# EAGLE design PoolTable (EAGLE 9.3.0)
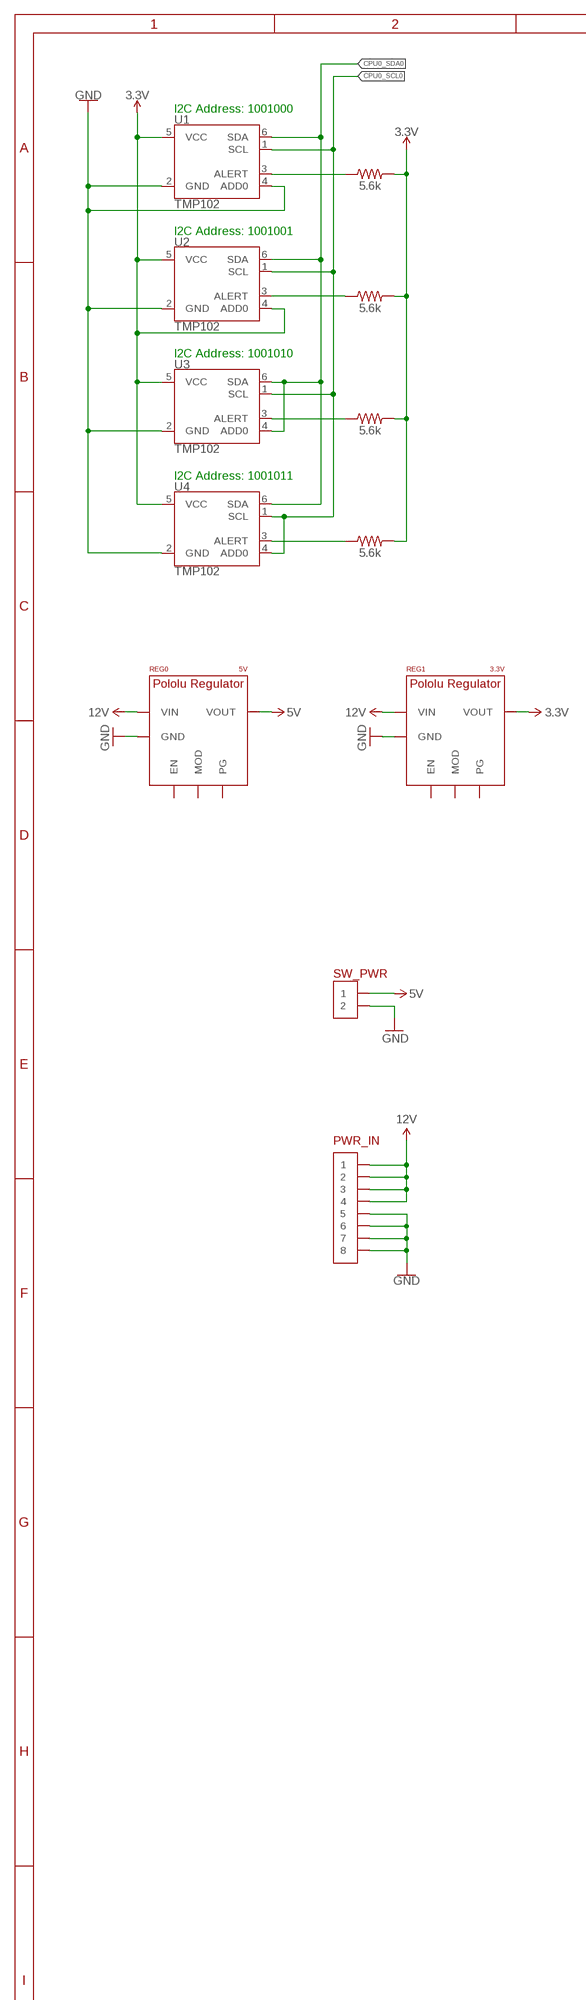
[diagram p0: schematic, sheet 1, part 1 of 2]
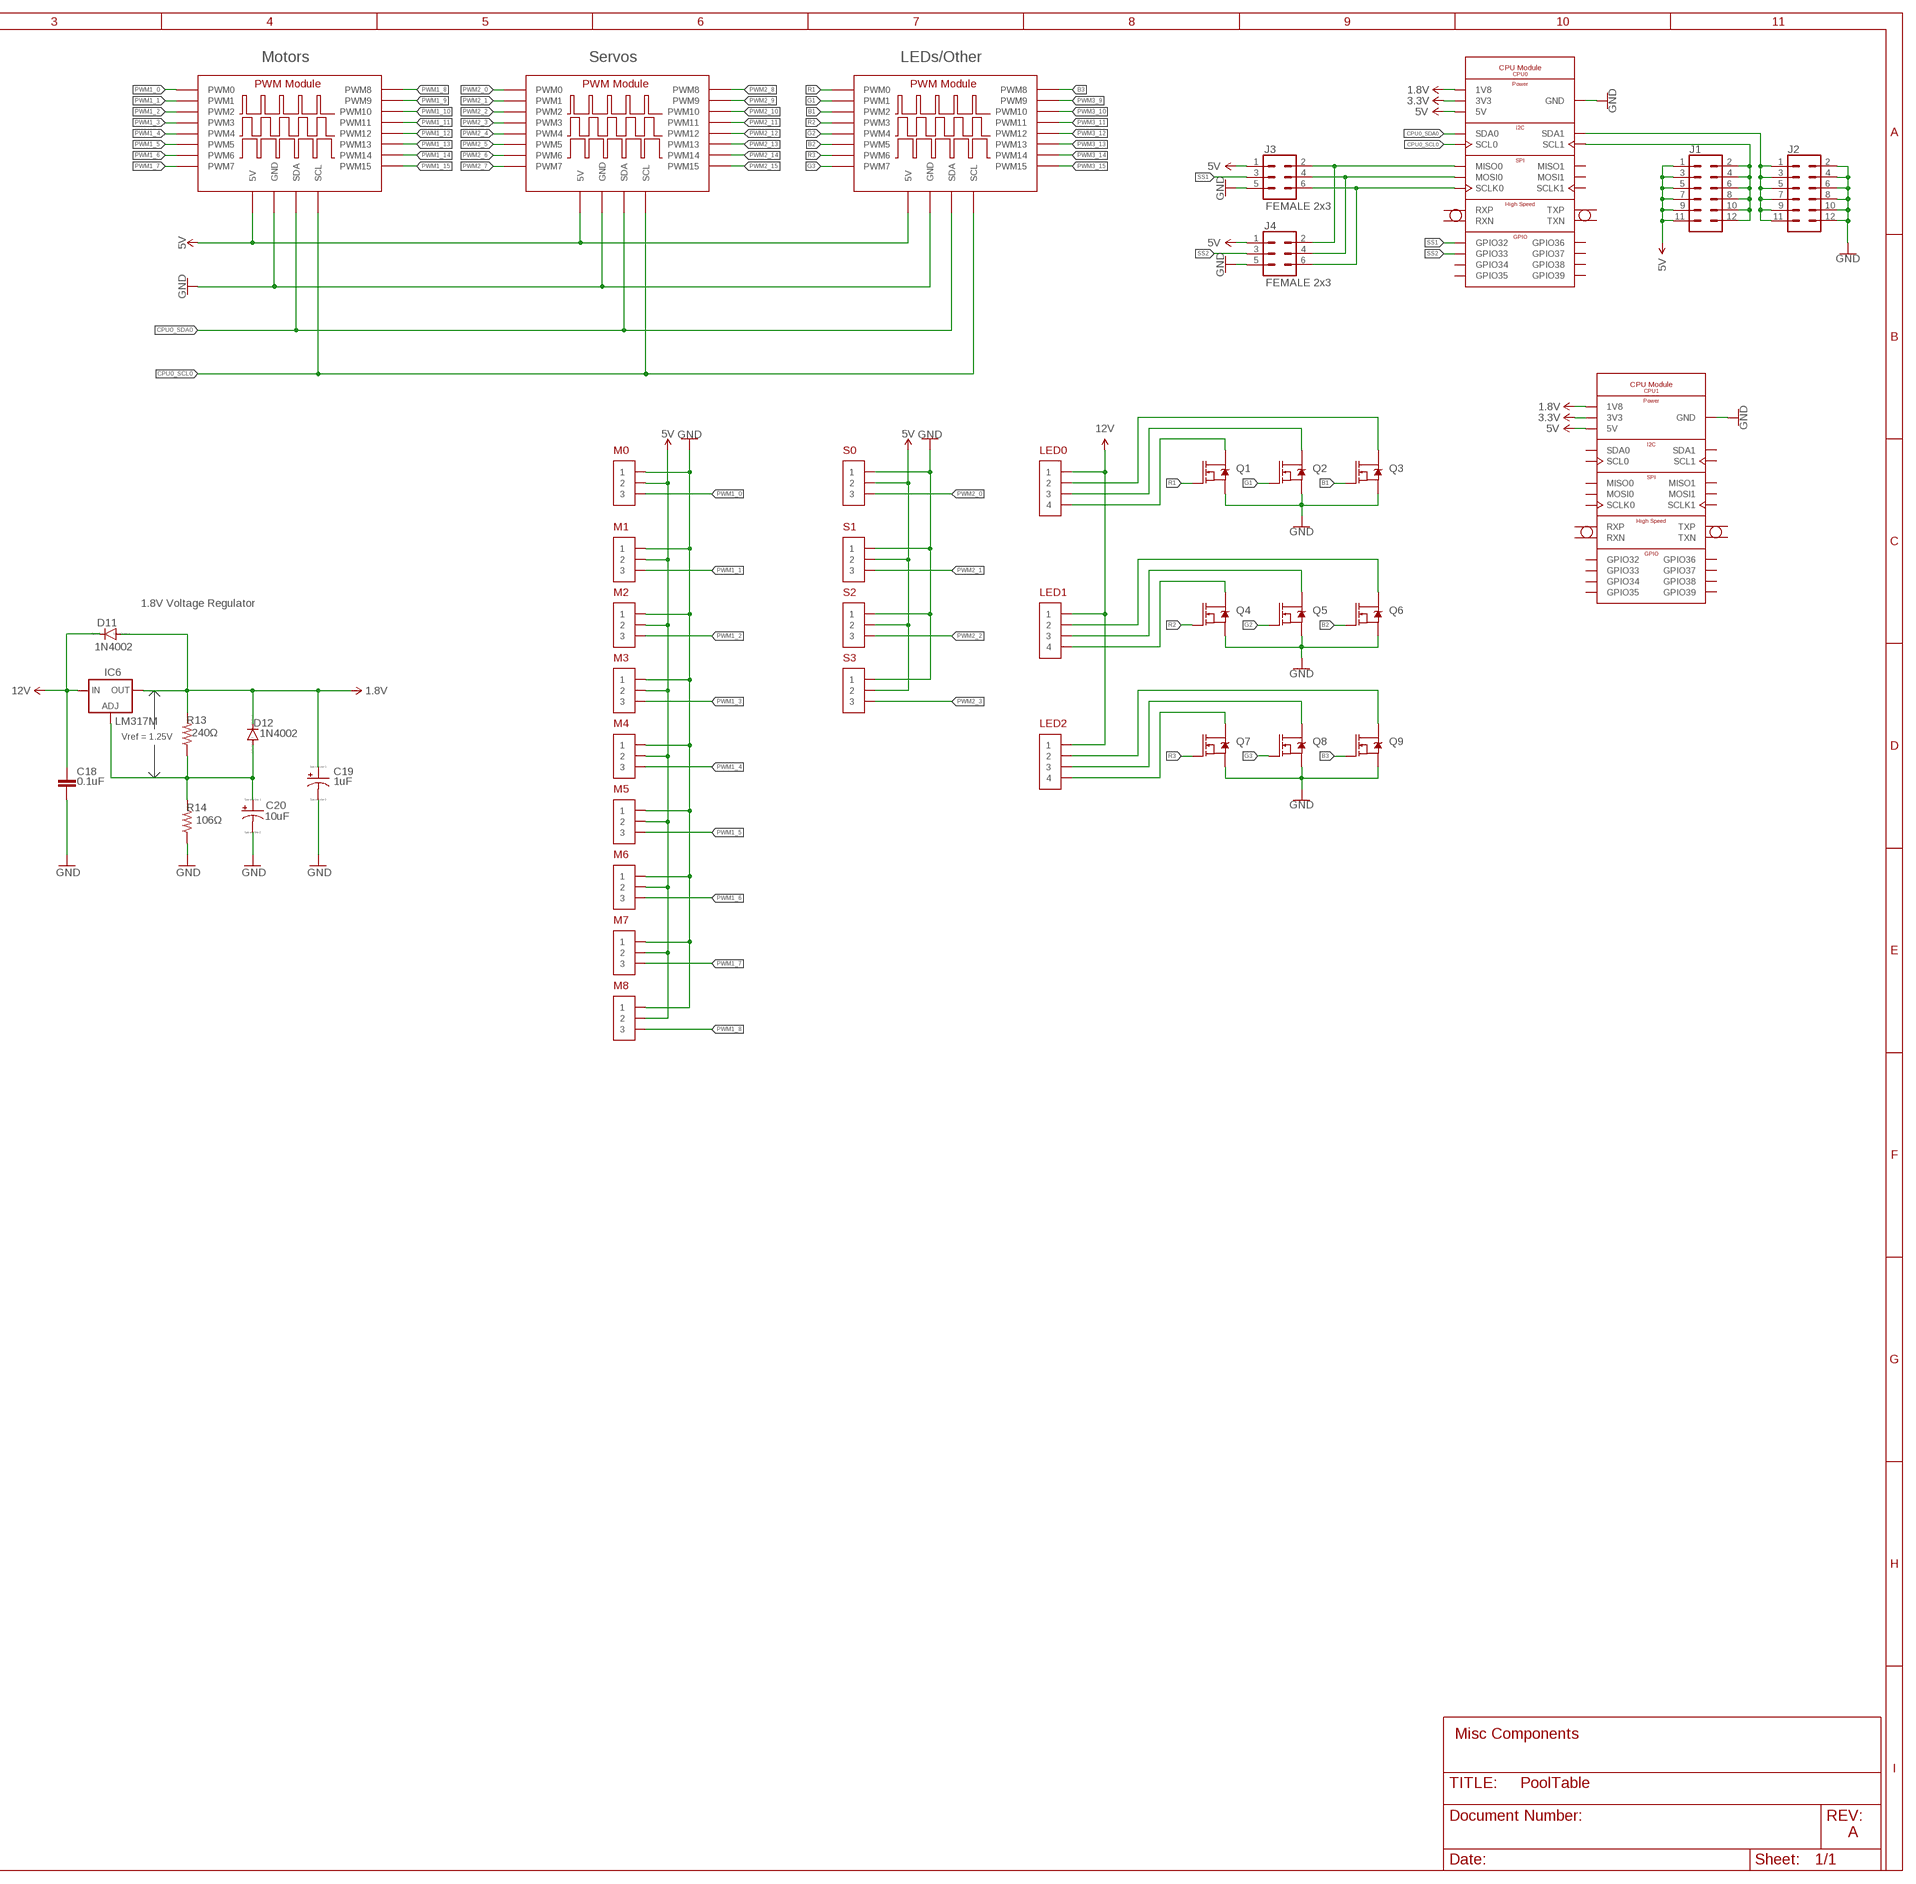
[diagram p1: schematic, sheet 1, part 2 of 2]

## Parts
C18  0.1uF  C-EU075-052X106  [C075-052X106]
C19  1uF  CPOL-US085CS-1AR  [085CS_1AR]
C20  10uF  CPOL-US085CS-1AR  [085CS_1AR]
CPU0  CPU_MODULE  [CPU_MODULE]
CPU1  CPU_MODULE  [CPU_MODULE]
D11  1N4002  1N4004  [DO41-10]
D12  1N4002  1N4004  [DO41-10]
IC6  LM317MBSTT3  [SOT223]
J1  2X6 FEMALE  CONN_06X2PTH_FEMALE  [2X6]
J2  2X6 FEMALE  CONN_06X2PTH_FEMALE  [2X6]
J3  FEMALE 2x3  CONN_03X2FEMALE  [2X3]
J4  FEMALE 2x3  CONN_03X2FEMALE  [2X3]
LED0  MOLEX-ULTRAFIT-1X04VERT  [MOLEX-ULTRAFIT-1X04V]
LED1  MOLEX-ULTRAFIT-1X04VERT  [MOLEX-ULTRAFIT-1X04V]
LED2  MOLEX-ULTRAFIT-1X04VERT  [MOLEX-ULTRAFIT-1X04V]
M0  MOLEX-ULTRAFIT-1X03-VERT  [MOLEX-ULTRAFIT-1X03V]
M1  MOLEX-ULTRAFIT-1X03VERT  [MOLEX-ULTRAFIT-1X03V]
M2  MOLEX-ULTRAFIT-1X03VERT  [MOLEX-ULTRAFIT-1X03V]
M3  MOLEX-ULTRAFIT-1X03VERT  [MOLEX-ULTRAFIT-1X03V]
M4  MOLEX-ULTRAFIT-1X03VERT  [MOLEX-ULTRAFIT-1X03V]
M5  MOLEX-ULTRAFIT-1X03VERT  [MOLEX-ULTRAFIT-1X03V]
M6  MOLEX-ULTRAFIT-1X03VERT  [MOLEX-ULTRAFIT-1X03V]
M7  MOLEX-ULTRAFIT-1X03VERT  [MOLEX-ULTRAFIT-1X03V]
M8  MOLEX-ULTRAFIT-1X03-VERT  [MOLEX-ULTRAFIT-1X03V]
PWM0  PWM_MODULE  [PWM_MODULE]
PWM1  PWM_MODULE  [PWM_MODULE]
PWM2  PWM_MODULE  [PWM_MODULE]
PWR_IN  MOLEX-ULTRAFIT-1X08  [MOLEX-ULTRAFIT-1X08]
Q1  60V/32A/35mΩ  MOSFET-NCH-FQP30N06L  [TO220V]
Q2  60V/32A/35mΩ  MOSFET-NCH-FQP30N06L  [TO220V]
Q3  60V/32A/35mΩ  MOSFET-NCH-FQP30N06L  [TO220V]
Q4  60V/32A/35mΩ  MOSFET-NCH-FQP30N06L  [TO220V]
Q5  60V/32A/35mΩ  MOSFET-NCH-FQP30N06L  [TO220V]
Q6  60V/32A/35mΩ  MOSFET-NCH-FQP30N06L  [TO220V]
Q7  60V/32A/35mΩ  MOSFET-NCH-FQP30N06L  [TO220V]
Q8  60V/32A/35mΩ  MOSFET-NCH-FQP30N06L  [TO220V]
Q9  60V/32A/35mΩ  MOSFET-NCH-FQP30N06L  [TO220V]
R9  5.6k  5.6KOHM-0603-1/10W-1%  [0603]
R12  5.6k  5.6KOHM-0603-1/10W-1%  [0603]
R13  240Ω  R-US_M0805  [M0805]
R14  106Ω  R-US_M0805  [M0805]
R15  5.6k  5.6KOHM-0603-1/10W-1%  [0603]
R18  5.6k  5.6KOHM-0603-1/10W-1%  [0603]
REG0  5V  POLOLU-REG  [POLOLU-REG]
REG1  3.3V  POLOLU-REG  [POLOLU-REG]
S0  MOLEX-ULTRAFIT-1X03VERT  [MOLEX-ULTRAFIT-1X03V]
S1  MOLEX-ULTRAFIT-1X03-VERT  [MOLEX-ULTRAFIT-1X03V]
S2  MOLEX-ULTRAFIT-1X03VERT  [MOLEX-ULTRAFIT-1X03V]
S3  MOLEX-ULTRAFIT-1X03VERT  [MOLEX-ULTRAFIT-1X03V]
SW_PWR  MOLEX-ULTRAFIT-1X02-HORIZ  [MOLEX-ULTRAFIT-1X02H]
U1  TMP102  [SOT563]
U2  TMP102  [SOT563]
U3  TMP102  [SOT563]
U4  TMP102  [SOT563]

## Nets
1.8V: C19.+ CPU0.19(1V8) CPU1.19(1V8) D11.A D12.C IC6.4(OUT) R13.2
3.3V: CPU0.20(3V3) CPU1.20(3V3) R9.2 R12.2 R15.2 R18.2 REG1.P$4(VOUT) REG1.P$7(VOUT) REG1.P$8(VOUT) U1.5(VCC) U2.4(ADD0) U2.5(VCC) U3.5(VCC) U4.5(VCC)
5V: CPU0.18(5V) CPU1.18(5V) J1.1 J1.3 J1.5 J1.7 J1.9 J1.11 J3.1 J4.1 M0.P$2 M1.P$2 M2.P$2 M3.P$2 M4.P$2 M5.P$2 M6.P$2 M7.P$2 M8.P$2 PWM0.5V PWM1.5V PWM2.5V REG0.P$4(VOUT) REG0.P$7(VOUT) REG0.P$8(VOUT) S0.P$2 S1.P$2 S2.P$2 S3.P$2 SW_PWR.P$1
12V: C18.1 D11.C IC6.3(IN) LED0.P$1 LED1.P$1 LED2.P$1 PWR_IN.P$1 PWR_IN.P$2 PWR_IN.P$3 PWR_IN.P$4 REG0.P$1(VIN) REG0.P$14(VIN) REG0.P$15(VIN) REG1.P$1(VIN) REG1.P$14(VIN) REG1.P$15(VIN)
B1: PWM1.PWM2 Q3.1(G)
B2: PWM1.PWM5 Q6.1(G)
B3: PWM1.PWM8 Q9.1(G)
CPU0_SCL0: CPU0.15(SCL0) PWM0.SCL PWM1.SCL PWM2.SCL U1.1(SCL) U2.1(SCL) U3.1(SCL) U4.1(SCL) U4.4(ADD0)
CPU0_SDA0: CPU0.13(SDA0) PWM0.SDA PWM1.SDA PWM2.SDA U1.6(SDA) U2.6(SDA) U3.4(ADD0) U3.6(SDA) U4.6(SDA)
G1: PWM1.PWM1 Q2.1(G)
G2: PWM1.PWM4 Q5.1(G)
G3: PWM1.PWM7 Q8.1(G)
GND: C18.2 C19.- C20.- CPU0.1(GND) CPU0.2(GND) CPU0.3(GND) CPU0.6(GND) CPU0.7(GND) CPU0.10(GND) CPU0.11(GND) CPU0.14(GND) CPU0.17(GND) CPU0.21(GND) CPU0.24(GND) CPU0.27(GND) CPU0.30(GND) CPU0.33(GND) CPU0.37(GND) CPU1.1(GND) CPU1.2(GND) CPU1.3(GND) CPU1.6(GND) CPU1.7(GND) CPU1.10(GND) CPU1.11(GND) CPU1.14(GND) CPU1.17(GND) CPU1.21(GND) CPU1.24(GND) CPU1.27(GND) CPU1.30(GND) CPU1.33(GND) CPU1.37(GND) J2.2 J2.4 J2.6 J2.8 J2.10 J2.12 J3.5 J4.5 M0.P$1 M1.P$1 M2.P$1 M3.P$1 M4.P$1 M5.P$1 M6.P$1 M7.P$1 M8.P$1 PWM0.GND PWM1.GND PWM2.GND PWR_IN.P$5 PWR_IN.P$6 PWR_IN.P$7 PWR_IN.P$8 Q1.3(S) Q2.3(S) Q3.3(S) Q4.3(S) Q5.3(S) Q6.3(S) Q7.3(S) Q8.3(S) Q9.3(S) R14.1 REG0.P$2(GND) REG0.P$3(GND) REG0.P$5(GND) REG0.P$6(GND) REG0.P$11(GND) REG0.P$12(GND) REG0.P$16(GND) REG0.P$17(GND) REG1.P$2(GND) REG1.P$3(GND) REG1.P$5(GND) REG1.P$6(GND) REG1.P$11(GND) REG1.P$12(GND) REG1.P$16(GND) REG1.P$17(GND) S0.P$1 S1.P$1 S2.P$1 S3.P$1 SW_PWR.P$2 U1.2(GND) U1.4(ADD0) U2.2(GND) U3.2(GND) U4.2(GND)
N$1: LED0.P$4 Q1.2(D)
N$2: LED0.P$3 Q2.2(D)
N$3: LED0.P$2 Q3.2(D)
N$4: CPU0.12(SCL1) J1.2 J1.4 J1.6 J1.8 J1.10 J1.12
N$5: CPU0.16(SDA1) J2.1 J2.3 J2.5 J2.7 J2.9 J2.11
N$6: R9.1 U1.3(ALERT)
N$7: C20.+ D12.A IC6.1(ADJ) R13.1 R14.2
N$8: LED1.P$4 Q4.2(D)
N$9: R12.1 U3.3(ALERT)
N$10: LED1.P$3 Q5.2(D)
N$11: LED1.P$2 Q6.2(D)
N$12: R15.1 U4.3(ALERT)
N$13: LED2.P$4 Q7.2(D)
N$14: LED2.P$3 Q8.2(D)
N$15: R18.1 U2.3(ALERT)
N$16: LED2.P$2 Q9.2(D)
N$17: CPU0.39(MISO0) J3.2 J4.2
N$18: CPU0.40(MOSI0) J3.4 J4.4
N$19: CPU0.38(SCLK0) J3.6 J4.6
PWM1_0: M0.P$3 PWM0.PWM0
PWM1_1: M1.P$3 PWM0.PWM1
PWM1_2: M2.P$3 PWM0.PWM2
PWM1_3: M3.P$3 PWM0.PWM3
PWM1_4: M4.P$3 PWM0.PWM4
PWM1_5: M5.P$3 PWM0.PWM5
PWM1_6: M6.P$3 PWM0.PWM6
PWM1_7: M7.P$3 PWM0.PWM7
PWM1_8: M8.P$3 PWM0.PWM8
PWM1_9: PWM0.PWM9
PWM1_10: PWM0.PWM10
PWM1_11: PWM0.PWM11
PWM1_12: PWM0.PWM12
PWM1_13: PWM0.PWM13
PWM1_14: PWM0.PWM14
PWM1_15: PWM0.PWM15
PWM2_0: PWM2.PWM0 S0.P$3
PWM2_1: PWM2.PWM1 S1.P$3
PWM2_2: PWM2.PWM2 S2.P$3
PWM2_3: PWM2.PWM3 S3.P$3
PWM2_4: PWM2.PWM4
PWM2_5: PWM2.PWM5
PWM2_6: PWM2.PWM6
PWM2_7: PWM2.PWM7
PWM2_8: PWM2.PWM8
PWM2_9: PWM2.PWM9
PWM2_10: PWM2.PWM10
PWM2_11: PWM2.PWM11
PWM2_12: PWM2.PWM12
PWM2_13: PWM2.PWM13
PWM2_14: PWM2.PWM14
PWM2_15: PWM2.PWM15
PWM3_9: PWM1.PWM9
PWM3_10: PWM1.PWM10
PWM3_11: PWM1.PWM11
PWM3_12: PWM1.PWM12
PWM3_13: PWM1.PWM13
PWM3_14: PWM1.PWM14
PWM3_15: PWM1.PWM15
R1: PWM1.PWM0 Q1.1(G)
R2: PWM1.PWM3 Q4.1(G)
R3: PWM1.PWM6 Q7.1(G)
SS1: CPU0.32(GPIO32) J3.3
SS2: CPU0.31(GPIO33) J4.3
Unconnected: CPU0.4(TXN) CPU0.5(TXP) CPU0.8(RXN) CPU0.9(RXP) CPU0.22(GPIO39) CPU0.23(GPIO38) CPU0.25(GPIO37) CPU0.26(GPIO36) CPU0.28(GPIO35) CPU0.29(GPIO34) CPU0.34(SCLK1) CPU0.35(MISO1) CPU0.36(MOSI1) CPU1.4(TXN) CPU1.5(TXP) CPU1.8(RXN) CPU1.9(RXP) CPU1.12(SCL1) CPU1.13(SDA0) CPU1.15(SCL0) CPU1.16(SDA1) CPU1.22(GPIO39) CPU1.23(GPIO38) CPU1.25(GPIO37) CPU1.26(GPIO36) CPU1.28(GPIO35) CPU1.29(GPIO34) CPU1.31(GPIO33) CPU1.32(GPIO32) CPU1.34(SCLK1) CPU1.35(MISO1) CPU1.36(MOSI1) CPU1.38(SCLK0) CPU1.39(MISO0) CPU1.40(MOSI0) REG0.P$9(PG) REG0.P$10(MOD) REG0.P$13(EN) REG1.P$9(PG) REG1.P$10(MOD) REG1.P$13(EN)

## Notes on the sheet
- Motors | Servos | LEDs/Other
- I2C Address: 1001000
- I2C Address: 1001001
- I2C Address: 1001010
- I2C Address: 1001011
- 1.8V Voltage Regulator
- Vref = 1.25V
- Misc Components
- A

## Library data of the parts
C18 = rcl:C-EU: CAPACITOR, European symbol; SPICEPREFIX: C
C19 C20 = resistor:CPOL-US: POLARIZED CAPACITOR, American symbol
CPU0 CPU1 = Modules:CPU_MODULE
D11 D12 = diode:1N4004: DIODE general purpose rectifier, 1 A
IC6 = v-reg:LM317?*: 500 mA Adjustable Output Positive Voltage Regulator Source: http://www.onsemi.co.jp .. LM317M-D.PDF; PARTNUMBER: LM317M
J1 J2 = SparkFun-Connectors:CONN_06X2: Multi connection point. Often used as Generic Header-pin footprint for 0.1 inch spaced/style header connections On any of the 0.1 inch spaced packages, you can populate with these: Break Away Headers - Straight (PRT-00116) Break Away Male Headers - Right Angle (PRT-00553) Female Headers (PRT-00115) Break Away Headers - Machine Pin (PRT-00117) Break Away Female Headers - Swiss Machine Pin (PRT-00743); PROD_ID: CONN-12423
J3 J4 = SparkFun-Connectors:CONN_03X2: Multi connection point. Often used as Generic Header-pin footprint for 0.1 inch spaced/style header connections You can populate with any combo of single row headers, but if you'd like an exact match, check these: Header - 2x3 (Male, 0.1") (PRT-12807) Header - 2x3 (Female, 0.1") (PRT-13010) 2x3 Pin Shrouded Header (PRT-10877) On any of the 0.1 inch spaced packages, you can populate with these: Break Away Headers - Straight (PRT-00116) Break Away Male Headers - Right Angle (PRT-00553) Female Headers (PRT-00115) Break Away Headers - Machine Pin (PRT-00117) Break Away Female Headers - Swiss Machine Pin (PRT-00743) Special note: the shrouded connector mates well with our 3x2 ribbon cables: Ribbon Crimp Connector - 6-pin (2x3, Female) (PRT-10651) Ribbon Cable - 6 wire (15ft) (PRT-10646); PROD_ID: CONN-11566
LED0 LED1 LED2 = External:MOLEX-ULTRAFIT-1X04
M0 M8 S1 = MolexUltrafit:MOLEX-ULTRAFIT-1X03
M1-M7 S0 S2 S3 = External:MOLEX-ULTRAFIT-1X03
PWM0 PWM1 PWM2 = Modules:PWM_MODULE
PWR_IN = External:MOLEX-ULTRAFIT-1X08
Q1-Q9 = SparkFun-DiscreteSemi:MOSFET-NCH: N-channel MOSFETs Voltage controlled devices that allow control of high current outputs. SparkFun Products: SparkFun OpenScale <https://www.sparkfun.com/products/13261> SparkFun Digital Sandbox <https://www.sparkfun.com/products/12651> SparkFun Monster Moto Shield <https://www.sparkfun.com/products/10182> SparkFun MOSFET Power Controller <https://www.sparkfun.com/products/11214>; PROD_ID: TRANS-10060
R9 R12 R15 R18 = SparkFun-Resistors:5.6KOHM: 5.6kΩ resistor A resistor is a passive two-terminal electrical component that implements electrical resistance as a circuit element. Resistors act to reduce current flow, and, at the same time, act to lower voltage levels within circuits. - Wikipedia; PROD_ID: RES-12378
R13 R14 = resistor:R-US_: RESISTOR, American symbol
REG0 REG1 = External:POLOLU-REG
SW_PWR = MolexUltrafit:MOLEX-ULTRAFIT-1X02
U1-U4 = SparkFun-Sensors:TMP102: Texas Instruments TMP102 Low-Power Digital Temperature Sensor The TMP102 is a digital sensor (I2C a.k.a. TWI), has a resolution of 0.0625°C, and is accurate up to 0.5°C. This is a very handy sensor that requires a very low-current. Datasheet SparkFun Products SparkFun Digital Temperature Sensor Breakout - TMP102 (SEN-11931); PROD_ID: IC-09303

## Net classes
0 default: width 0.254 mm
1 diff pair: width 0.406 mm

## Board
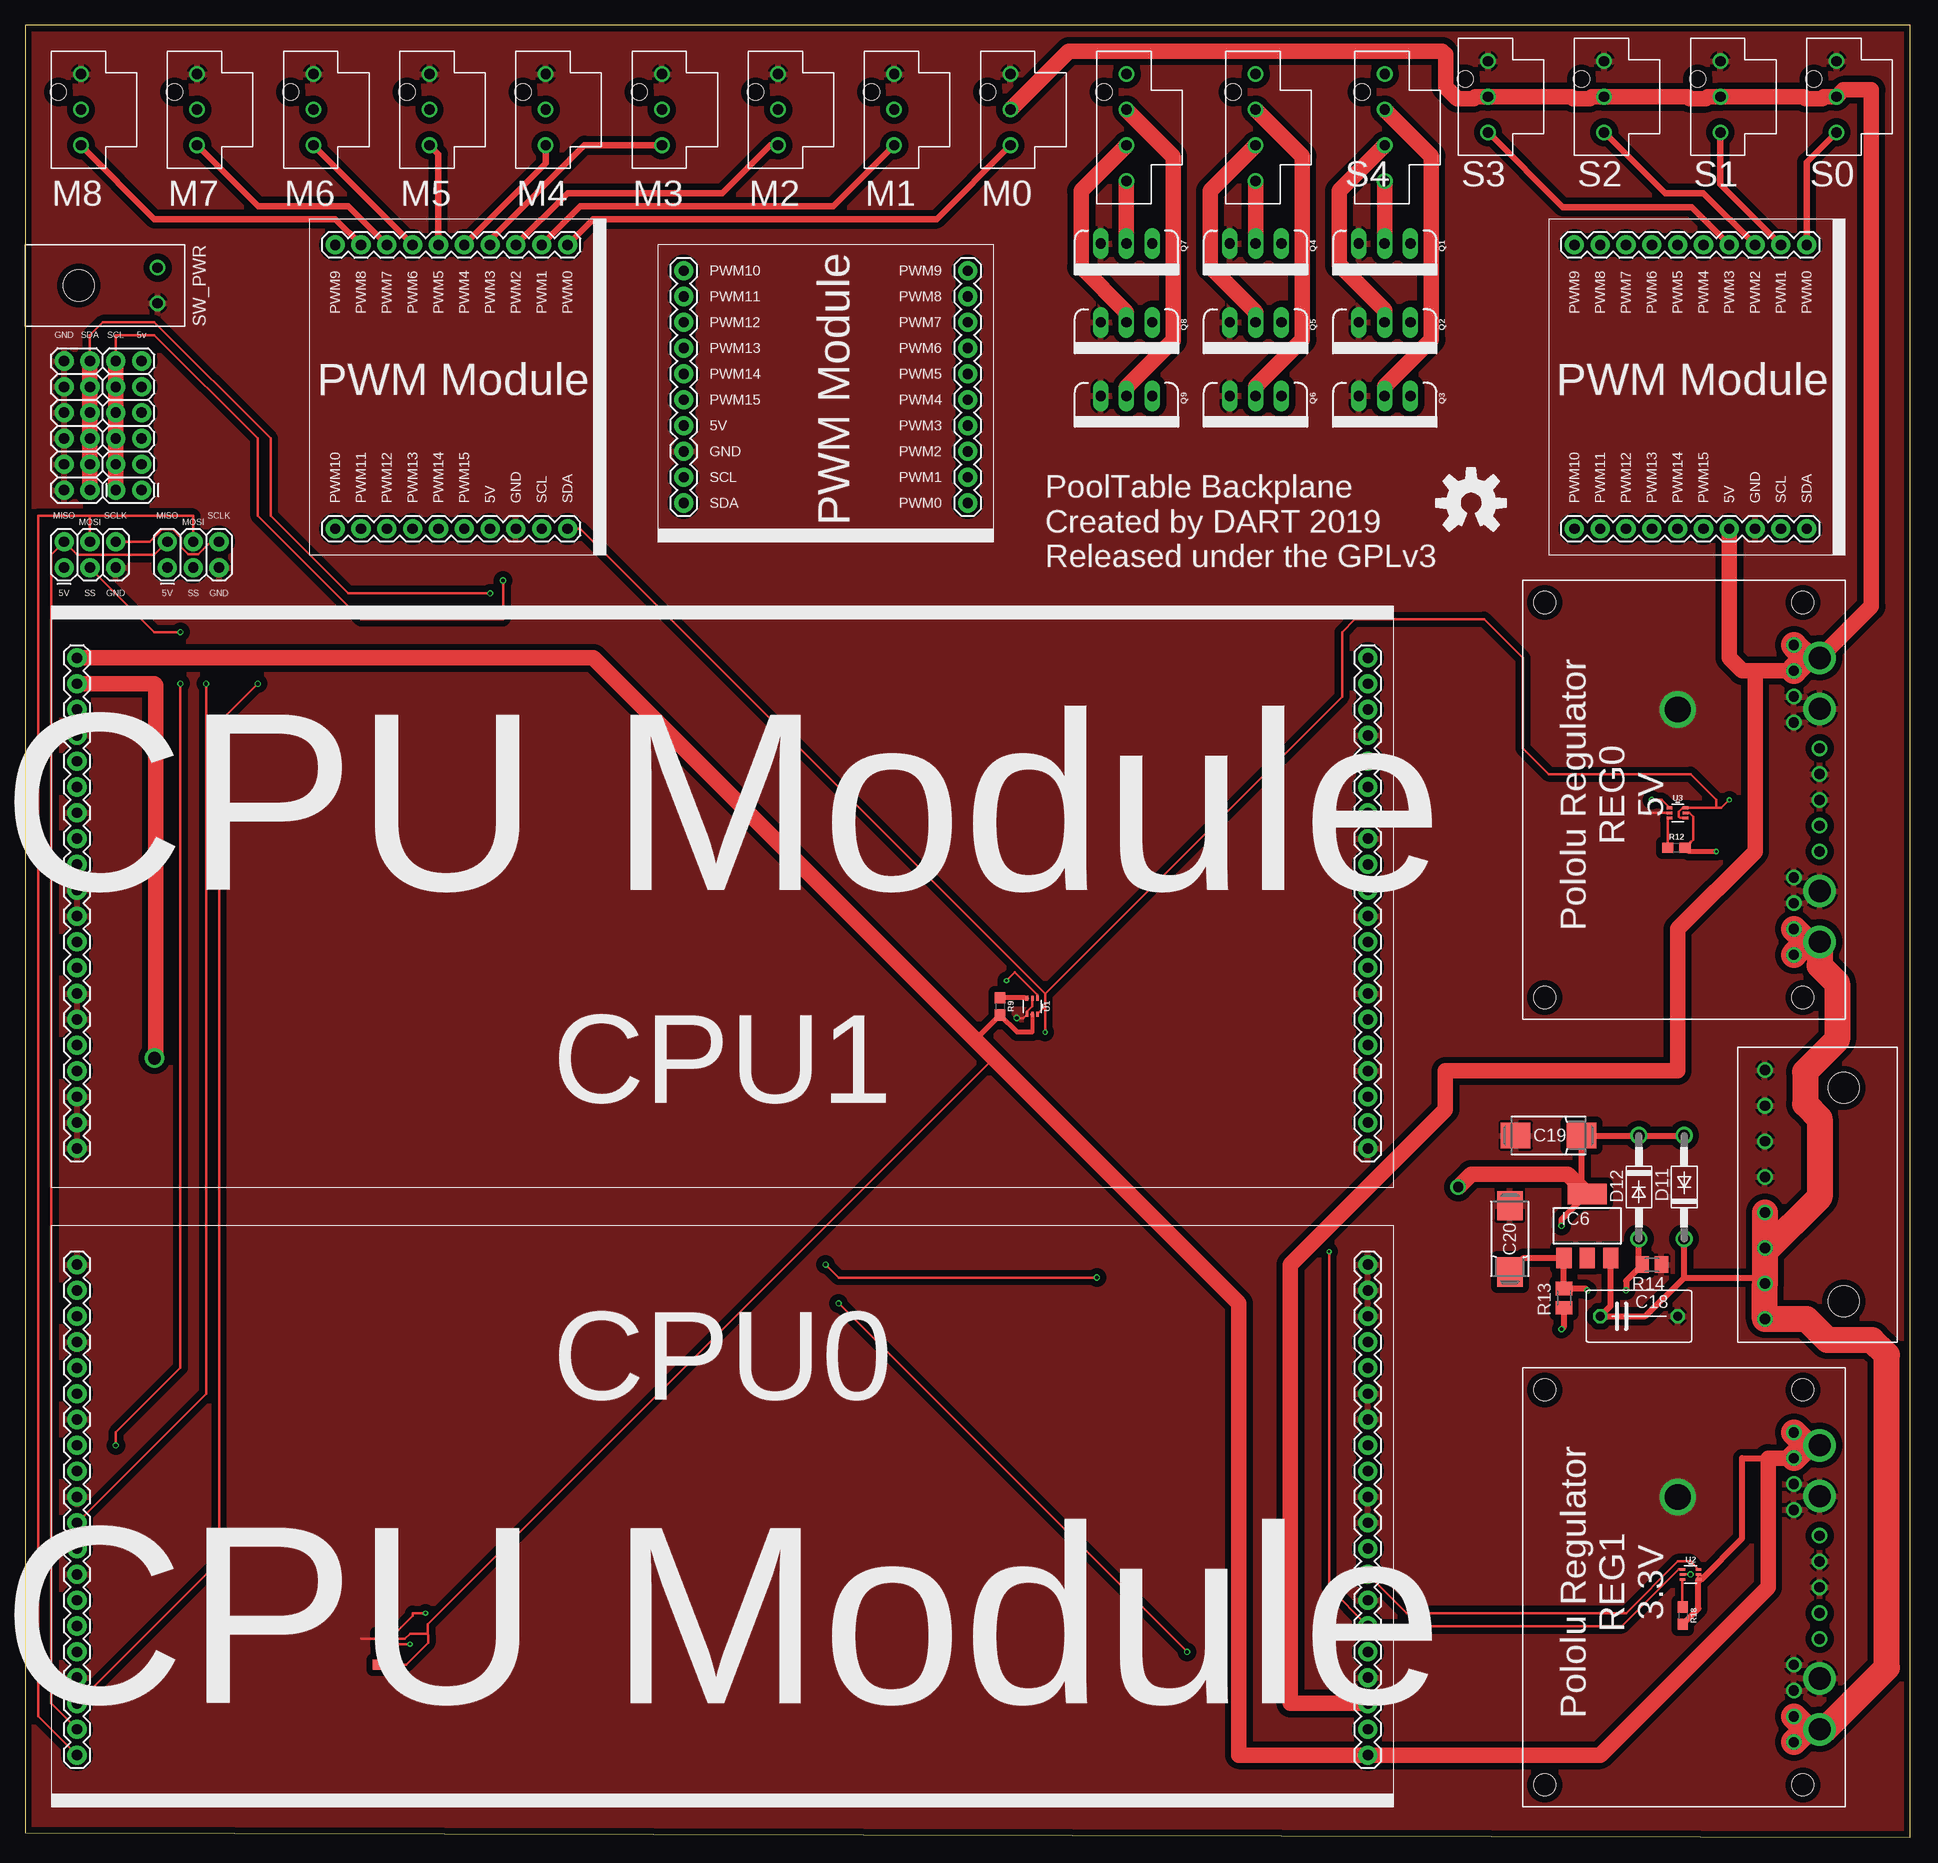
[diagram p2: board, top side]
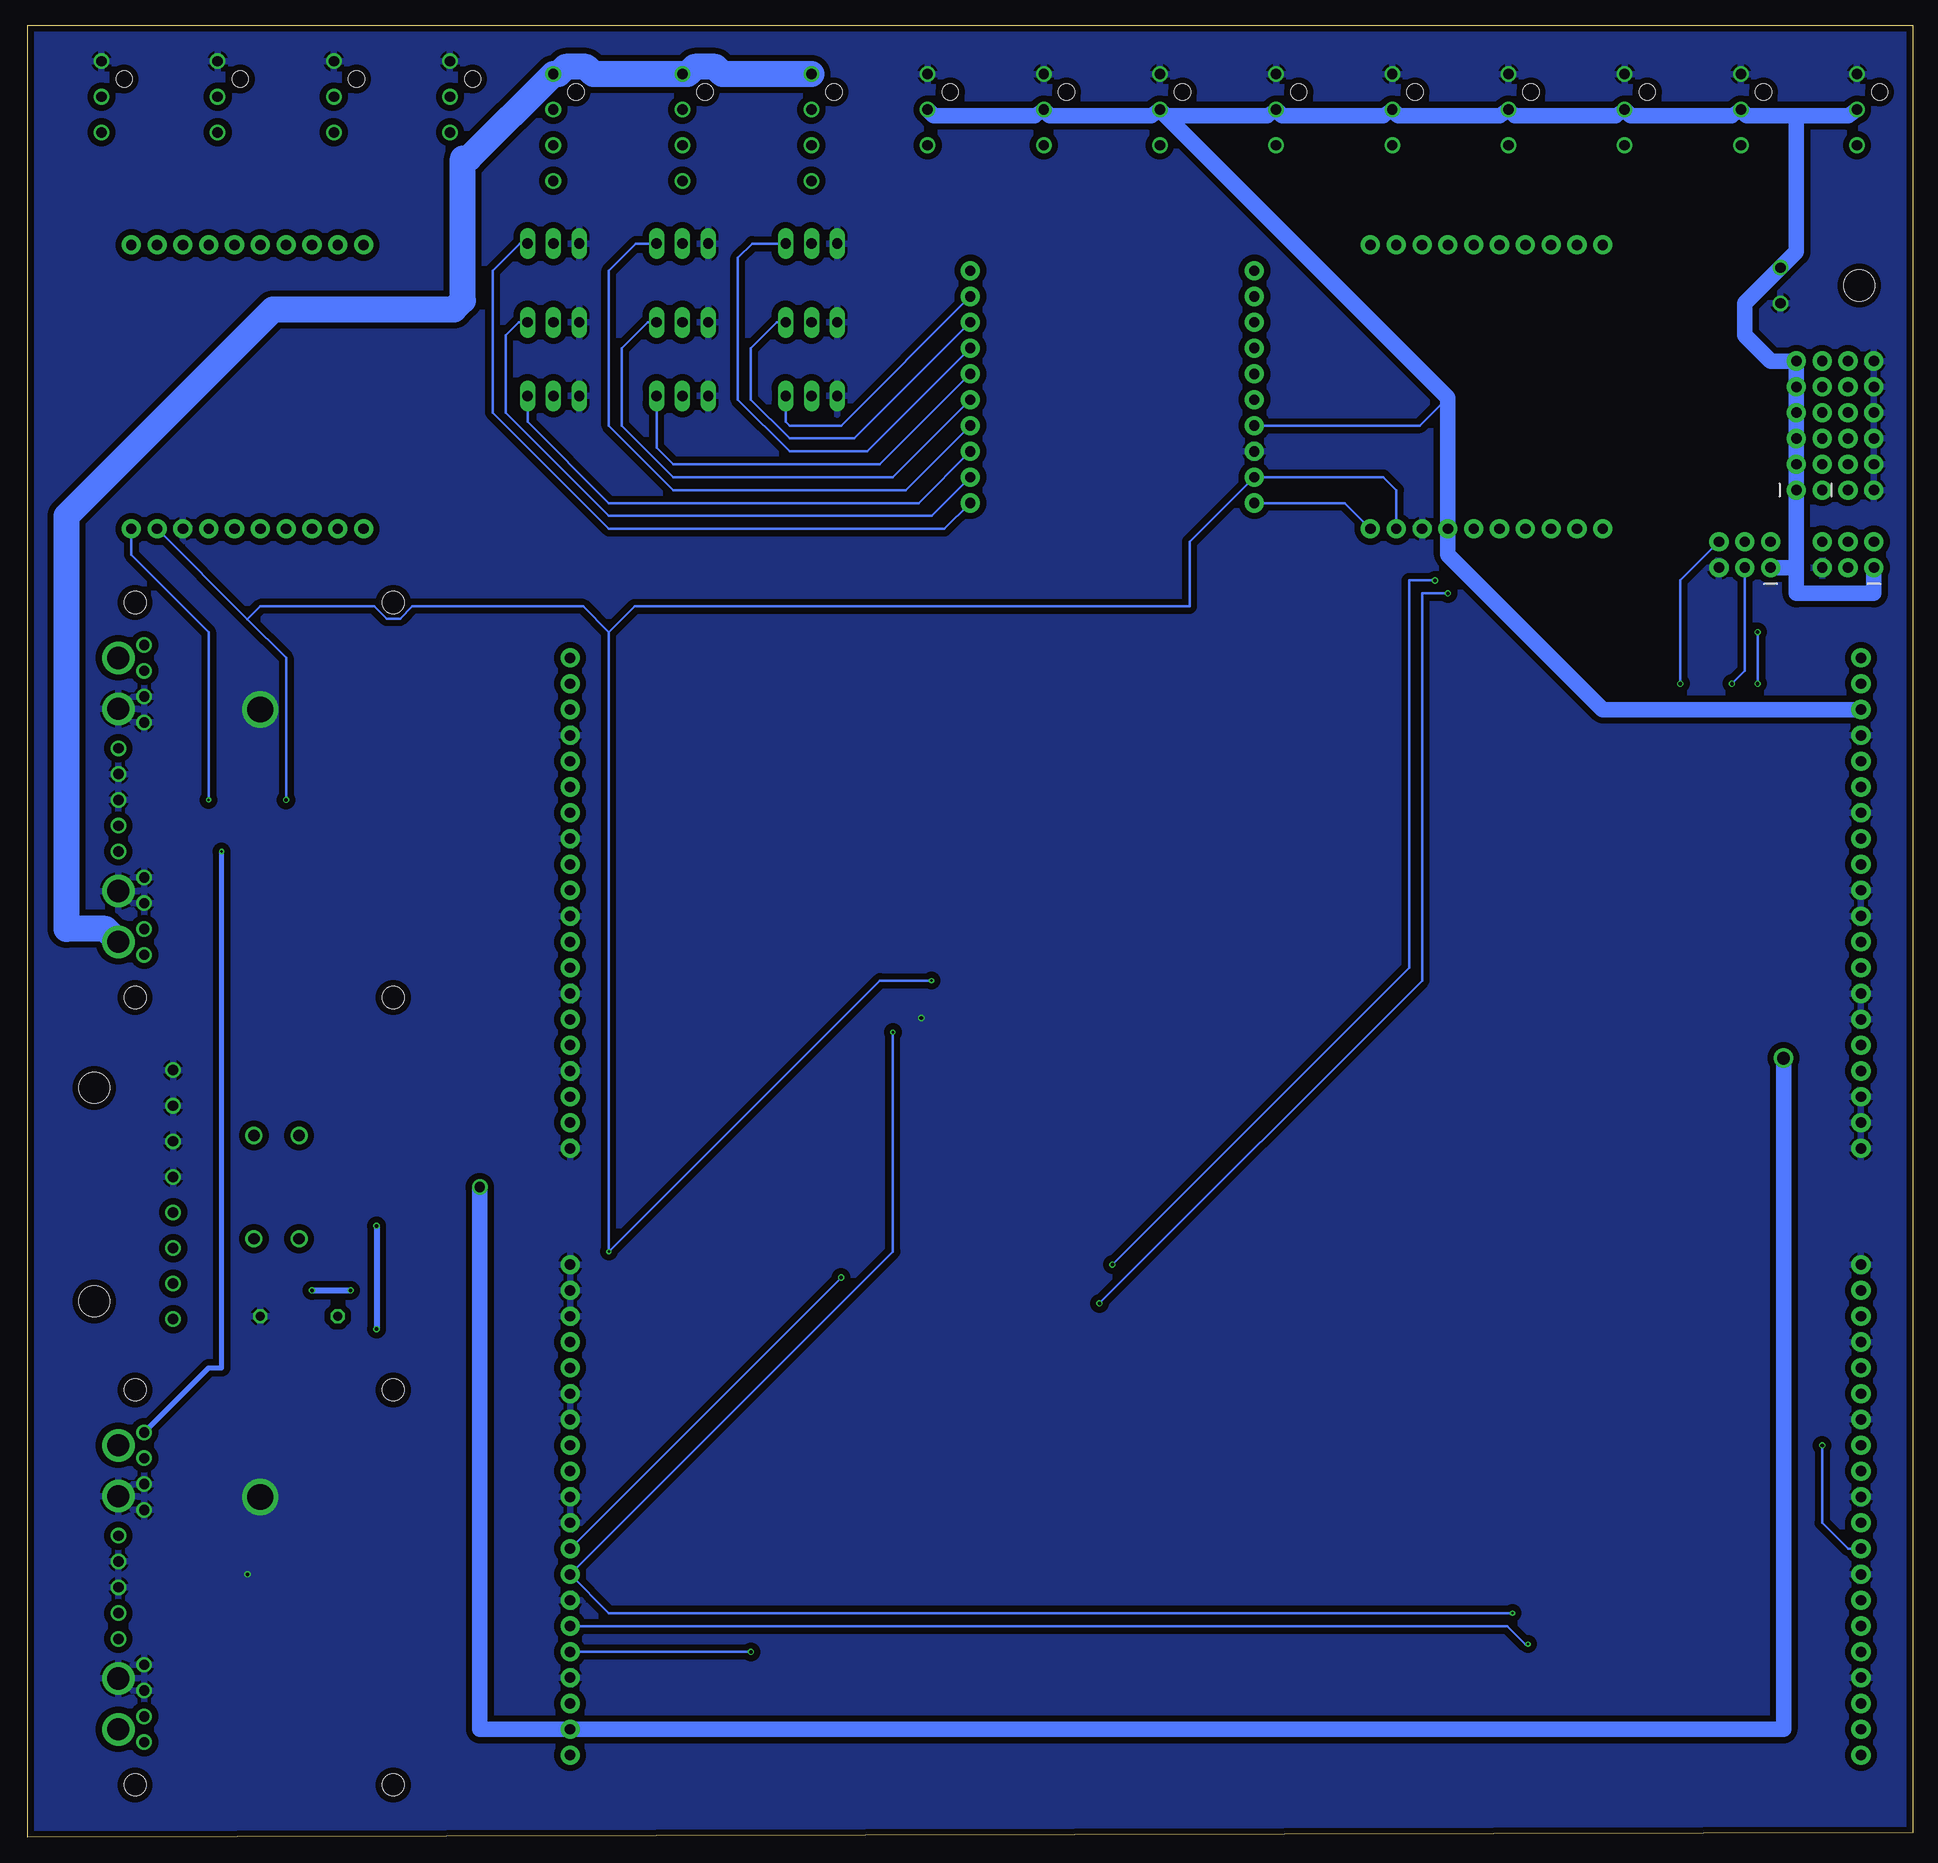
[diagram p3: board, bottom side, seen from below]

Size 185.42 x 178.27 mm. Coordinates in mm from the lower left corner, seen from the top.
Outline: 0,0.47 185.42,0 185.42,178.27 0,178.27 0,0.47
Copper layers (1*16): Top 0.035559375mm / dielectric 1.6mm / Bottom 0.035559375mm
Design rules "oshpark-2layer": minimum track width 6mil, minimum drill 10mil, track to track 6mil, track to pad 6mil, pad to pad 6mil, via to via 6mil, smd to smd 6mil, copper to edge 15mil, drill to drill 6mil, minimum pad ring 5mil, minimum via ring 5mil, stop-mask expansion 2.5mil, vias tented up to drill 0mil, thermal gap 10mil

### Footprints (pad centres in the part's own frame; a part is rotated, then mirrored left to right if it is on the bottom)
C075-052X106 = drill 0.914 octagon: 1 -3.81,0; 2 3.81,0
085CS_1AR = smd 2.9 x 2.5: + 3.25,0; - -3.25,0
CPU_MODULE = drill 1.016 pad 1.88: 1 -63.5,-20.32; 2 -63.5,-17.78; 3 -63.5,-15.24; 4 -63.5,-12.7; 5 -63.5,-10.16; 6 -63.5,-7.62; 7 -63.5,-5.08; 8 -63.5,-2.54; 9 -63.5,0; 10 -63.5,2.54; 11 -63.5,5.08; 12 -63.5,7.62; 13 -63.5,10.16; 14 -63.5,12.7; 15 -63.5,15.24; 16 -63.5,17.78; 17 -63.5,20.32; 18 -63.5,22.86; 19 -63.5,25.4; 20 -63.5,27.94; 21 63.5,-20.32; 22 63.5,-17.78; 23 63.5,-15.24; 24 63.5,-12.7; 25 63.5,-10.16; 26 63.5,-7.62; 27 63.5,-5.08; 28 63.5,-2.54; 29 63.5,0; 30 63.5,2.54; 31 63.5,5.08; 32 63.5,7.62; 33 63.5,10.16; 34 63.5,12.7; 35 63.5,15.24; 36 63.5,17.78; 37 63.5,20.32; 38 63.5,22.86; 39 63.5,25.4; 40 63.5,27.94
DO41-10 = drill 1.118: A 5.08,0; C -5.08,0
SOT223 = smd 1.5 x 2: 1 -2.3,-3.15; 2 0,-3.15; 3 2.3,-3.15 | smd 3.8 x 2: 4 0,3.15
2X6 = drill 1.016 pad 1.88: 1 0,0; 2 0,2.54; 3 2.54,0; 4 2.54,2.54; 5 5.08,0; 6 5.08,2.54; 7 7.62,0; 8 7.62,2.54; 9 10.16,0; 10 10.16,2.54; 11 12.7,0; 12 12.7,2.54
2X3 = drill 1.016 pad 1.88: 1 0,0; 2 0,2.54; 3 2.54,0; 4 2.54,2.54; 5 5.08,0; 6 5.08,2.54
MOLEX-ULTRAFIT-1X04V = drill 1.02: P$1 2.25,2.93; P$2 5.75,2.93; P$3 9.25,2.93; P$4 12.75,2.93 | hole 1.6: 4,0.7
MOLEX-ULTRAFIT-1X03V = drill 1.02: P$1 2.25,2.93; P$2 5.75,2.93; P$3 9.25,2.93 | hole 1.6: 4,0.7
PWM_MODULE = drill 1.016 pad 1.88: 5V 30.48,17.78; GND 30.48,20.32; PWM0 2.54,25.4; PWM1 2.54,22.86; PWM2 2.54,20.32; PWM3 2.54,17.78; PWM4 2.54,15.24; PWM5 2.54,12.7; PWM6 2.54,10.16; PWM7 2.54,7.62; PWM8 2.54,5.08; PWM9 2.54,2.54; PWM10 30.48,2.54; PWM11 30.48,5.08; PWM12 30.48,7.62; PWM13 30.48,10.16; PWM14 30.48,12.7; PWM15 30.48,15.24; SCL 30.48,22.86; SDA 30.48,25.4
MOLEX-ULTRAFIT-1X08 = drill 1.02: P$1 2.25,13; P$2 5.75,13; P$3 9.25,13; P$4 12.75,13; P$5 16.25,13; P$6 19.75,13; P$7 23.25,13; P$8 26.75,13 | hole 3.05: 4,5.25; 25,5.25
TO220V = drill 1.016 long: 1 -2.54,0; 2 0,0; 3 2.54,0
0603 = smd 1.1 x 1: 1 -0.85,0; 2 0.85,0
M0805 = smd 1.3 x 1.6: 1 -0.95,0; 2 0.95,0
POLOLU-REG = drill 2.184: P$1 7.62,2.54; P$2 12.624,2.54; P$3 30.556,2.54; P$4 35.56,2.54 | drill 1.016: P$5 29.21,5.08; P$6 31.75,5.08; P$7 34.29,5.08; P$8 36.83,5.08; P$9 16.51,2.54; P$10 19.05,2.54; P$11 21.59,2.54; P$12 24.13,2.54; P$13 26.67,2.54; P$14 6.35,5.08; P$15 8.89,5.08; P$16 11.43,5.08; P$17 13.97,5.08 | hole 2.184: 2.159,4.191; 41.021,4.191; 41.021,29.591; 2.159,29.591
MOLEX-ULTRAFIT-1X02H = drill 1.02: P$1 2.25,13; P$2 5.75,13 | hole 3.05: 4,5.25
SOT563 = smd 0.508 x 0.249: 1 -0.8,0.498; 2 -0.8,0.003; 3 -0.8,-0.506; 4 0.776,-0.506; 5 0.776,0.003; 6 0.776,0.498

### Placement (x,y rotation side)
C18  158.75,51.27 0 top
C19  149.86,69.05 0 top
C20  146.05,58.89 270 top
CPU0  68.58,36.03 180 top
CPU1  68.58,88.1 0 top
D11  163.19,63.97 90 top
D12  158.75,63.97 270 top
IC6  153.67,60.16 0 top
J1  11.43,132.55 90 top
J2  6.35,132.55 90 top
J3  3.81,124.93 0 top
J4  13.97,124.93 0 top
LED0  130.81,175.73 270 top
LED1  118.11,175.73 270 top
LED2  105.41,175.73 270 top
M0  93.98,175.73 270 top
M1  82.55,175.73 270 top
M2  71.12,175.73 270 top
M3  59.69,175.73 270 top
M4  48.26,175.73 270 top
M5  36.83,175.73 270 top
M6  25.4,175.73 270 top
M7  13.97,175.73 270 top
M8  2.54,175.73 270 top
PWM0  27.94,159.22 270 top
PWM1  95.25,156.68 180 top
PWM2  149.86,159.22 270 top
PWR_IN  184.15,48.73 90 top
Q1  133.73,156.81 180 top
Q2  133.73,149.06 180 top
Q3  133.73,141.82 180 top
Q4  121.03,156.81 180 top
Q5  121.03,149.06 180 top
Q6  121.03,141.82 180 top
Q7  108.33,156.81 180 top
Q8  108.33,149.06 180 top
Q9  108.33,141.82 180 top
R9  95.89,81.75 270 top
R12  162.43,97.37 0 top
R13  151.38,53.05 270 top
R14  160.02,56.35 180 top
R15  35.56,16.98 0 top
R18  163.07,21.81 270 top
REG0  179.07,80.48 90 top
REG1  179.07,3.01 90 top
S0  175.26,177 270 top
S1  163.83,177 270 top
S2  152.4,177 270 top
S3  140.97,177 270 top
SW_PWR  0,156.68 270 top
U1  99.06,81.75 270 top
U2  163.83,25.87 0 top
U3  162.56,100.8 0 top
U4  35.56,19.52 0 top
U$1  [OSHW-LOGO-L]  142.24,131.28 0 top

### Tracks (layer width: path | path; a pad name or v marks a point on that pad's centre or on a via)
1.8V  (via drill 0.35, 1.02, 1.27)
  Top 0.61: D11.A D12.C C19.+ 153.11,63.87 IC6.4 151.13,60.77 v151.13,60.16 | v151.13,50 151.38,50.25 R13.2
  Top 1.524: IC6.4 151.74,65.24 142.24,65.24 v140.97,63.97 | v12.7,76.67 12.83,76.8 12.83,113.37 12.7,113.5 CPU1.19
  Bottom 0.61: v151.13,60.16 v151.13,50
  Bottom 1.524: v140.97,63.97 140.97,10.63 CPU0.19 12.7,10.63 v12.7,76.67
3.3V  (via drill 0.25)
  Top 0.254: U3.5 163.7,100.8 164.08,100.42 164.08,98.17 163.83,97.92 | U2.4 U2.5 | U4.5 37.34,19.52 37.85,20.03 39.5,20.03 39.56,19.96 | 39.56,19.96 39.62,19.9 39.62,19.14 37.47,16.98 R15.2 | 95.25,76.67 39.56,20.98 39.56,19.96
  Top 0.305: 163.83,97.92 R12.2
  Top 0.381: U1.5 99.06,79.21
  Top 0.508: 99.06,79.21 97.58,79.21 R9.2 93.56,78.58 93.34,78.58 | v166.37,96.99 163.66,96.99 R12.2
  Top 0.61: R18.2 164.61,22.49 U2.4 164.86,25.36 168.91,29.41 168.91,37.3 171.45,37.3
  Top 1.524: REG1.P$7 171.45,37.3 171.45,24.6 154.94,8.09 CPU0.20 119.38,8.09 119.38,52.54 95.25,76.67 93.34,78.58 55.88,116.04 CPU1.20
  Top 2.54: REG1.P$4 175.26,38.57 | 175.26,38.57 REG1.P$7 | REG1.P$8 175.26,38.57
  Bottom 0.508: REG1.P$8 167.64,46.19 166.37,46.19 v166.37,96.99
5V
  Top 1.524: REG0.P$7 170.18,114.77 | 170.18,114.77 168.91,114.77 167.64,116.04 PWM2.5V | CPU0.18 124.46,13.17 124.46,56.35 139.7,71.59 139.7,75.4 162.56,75.4 162.56,89.37 170.18,96.99 170.18,114.77 | REG0.P$4 181.61,121.12 181.61,171.92 178.86,171.92 S0.P$2 176.96,171.25 176.76,171.06 175.16,171.06 174.96,171.25 S1.P$2 165.53,171.25 165.34,171.06 163.72,171.06 163.53,171.25 S2.P$2 154.1,171.25 153.91,171.06 152.29,171.06 152.1,171.25 S3.P$2 142.67,171.25 142.47,171.06 140.87,171.06 139.73,172.19 139.73,175.42 139.42,175.73 102.66,175.73 M0.P$2
  Top 2.54: REG0.P$7 175.26,116.04 | 175.26,116.04 REG0.P$4 | REG0.P$8 175.26,116.04
  Bottom 0.254: PWM1.5V 48.47,138.9 45.72,141.65
  Bottom 1.524: M8.P$2 6.35,169.38 11.43,169.38 | 11.43,169.38 16.3,169.38 M7.P$2 17.78,169.38 27.73,169.38 M6.P$2 29.21,169.38 39.16,169.38 M5.P$2 40.64,169.38 50.59,169.38 M4.P$2 52.07,169.38 62.02,169.38 M3.P$2 63.5,169.38 73.45,169.38 M2.P$2 | M2.P$2 74.93,169.38 84.88,169.38 M1.P$2 86.36,169.38 96.31,169.38 M0.P$2 | M2.P$2 45.72,141.65 PWM0.5V 45.72,126.2 30.48,110.96 CPU1.18 | 11.43,169.38 11.43,156 SW_PWR.P$1 16.51,150.92 16.51,147.79 13.97,145.25 J1.11 J1.9 J1.7 J1.5 J1.3 J1.1 11.43,124.93 | J3.1 3.81,122.39 11.43,122.39 11.43,124.93 | J4.1 11.43,124.93
12V
  Top 0.61: IC6.3 155.97,52.3 C18.1 159.38,51.27 163.19,55.08 | 163.19,55.08 D11.C | 163.19,55.08 170.55,55.08 PWR_IN.P$2
  Top 2.54: 171.15,57.62 PWR_IN.P$3 PWR_IN.P$4 | 171.15,57.62 PWR_IN.P$2 PWR_IN.P$1 175.26,50.98 177.32,48.92 181.68,48.92 183.13,47.46 183.13,16.69 177.07,10.63 REG1.P$1 175.26,10.63 | 175.26,88.1 REG0.P$15 | 171.15,57.62 176.53,63 176.53,70.71 175.09,72.15 175.09,75.31 178.26,78.48 178.26,84.04 176.53,85.77 REG0.P$1 175.26,88.1 | 175.26,10.63 REG1.P$14 | 175.26,10.63 REG1.P$15 | REG0.P$14 175.26,88.1
  Bottom 2.54: LED2.P$1 117.09,173.48 117.8,174.18 119.83,174.18 120.53,173.48 LED1.P$1 129.79,173.48 130.5,174.18 132.53,174.18 133.23,173.48 LED0.P$1 142.04,165.18 142.63,165.18 142.63,151.21 143.51,150.33 161.29,150.33 181.61,130.01 181.61,89.37 177.8,89.37 REG0.P$1
B1
  Bottom 0.254: PWM1.PWM2 97.79,131.28 128.27,131.28 136.27,139.28 Q3.1
B2
  Bottom 0.254: PWM1.PWM5 101.6,135.09 121.92,135.09 123.57,136.74 Q6.1
B3
  Bottom 0.254: PWM1.PWM8 105.41,138.9 110.49,138.9 110.87,139.28 Q9.1
CPU0_SCL0  (via drill 0.25, 0.35)
  Top 0.254: U2.1 162.65,26.37 157.07,20.79 CPU0.15 128.27,24.6 v128.27,57.62 | U1.1 99.57,82.91 97.35,85.12 v96.52,84.29 | v37.85,19.01 U4.4 35.76,19.01 35.4,19.38 35.4,19.75 35.12,20.03 34.77,20.03 U4.1 | v160.02,102.07 160.99,102.07 U3.1
  Bottom 0.254: CPU0.15 39.88,20.79 38.1,19.01 v37.85,19.01 | v96.52,84.29 101.6,84.29 v128.27,57.62 128.27,118.58 | 163.83,119.85 PWM2.SCL | 128.27,118.58 130.81,121.12 147.6,121.12 148.82,119.9 150.14,119.9 151.36,121.12 162.56,121.12 163.83,119.85 | 163.83,119.85 160.02,116.04 v160.02,102.07 | 128.27,118.58 125.73,121.12 71.12,121.12 71.12,127.47 PWM1.SCL 52.07,133.82 50.8,132.55 PWM0.SCL
CPU0_SDA0  (via drill 0.25)
  Top 0.254: U2.6 163.83,27.14 162.56,27.14 157.48,22.06 135.89,22.06 CPU0.13 | U1.6 100.33,81.75 | 100.33,81.75 100.33,83.02 | PWM0.SDA 54.61,128.74 100.33,83.02 | U4.6 38.1,21.78 38.1,22.06 v39.37,22.06 | v100.33,79.21 100.33,81.75 | v167.64,102.07 166.87,101.3 166.37,101.3 | 166.37,101.3 166.37,102.07 163.83,104.61 149.86,104.61 147.32,107.15 147.32,116.04 143.51,119.85 130.81,119.85 129.54,118.58 129.54,112.23 100.33,83.02 | U3.4 162.81,100.29 162.69,100.42 162.69,100.93 163.06,101.3 U3.6 166.37,101.3
  Bottom 0.254: v39.37,22.06 128.27,22.06 CPU0.13 100.33,57.62 v100.33,79.21 | PWM2.SDA 175.26,126.2 167.64,118.58 v167.64,102.07 | PWM0.SDA 55.88,131.28 PWM1.SDA
G1
  Bottom 0.254: PWM1.PWM1 96.52,130.01 128.27,130.01 138.43,140.17 138.43,147.79 137.16,149.06 Q2.1
G2
  Bottom 0.254: PWM1.PWM4 100.33,133.82 121.92,133.82 127,138.9 127,146.52 124.46,149.06 Q5.1
G3
  Bottom 0.254: PWM1.PWM7 104.14,137.63 110.49,137.63 114.3,141.44 114.3,146.52 111.76,149.06 Q8.1
GND  (via drill 0.35, 2.54)
  Top 0.254: v97.54,80.61 98.19,80.61 U1.4 98.59,81.01 98.59,81.27 99.06,81.75 U1.2 | U3.2 160.02,100.8 | U2.2 v163.83,25.87 | U4.2 33.02,19.52
  other vias: 162.56,33.49 162.56,110.96
  pour Top (isolate 0.61): -2.54,179.54 -2.54,-2.07 189.23,-2.07 189.23,179.54
  pour Bottom (isolate 0.61): -6.35,183.35 -6.35,-5.88 193.04,-5.88 193.04,183.35
N$1
  Top 1.524: Q1.2 LED0.P$4
N$2
  Top 1.524: Q2.2 133.73,150.25 129.26,154.72 129.26,162 LED0.P$3
N$3
  Top 1.524: Q3.2 133.74,142.76 138.33,147.35 138.33,165.41 133.76,169.98 LED0.P$2
N$4  (via drill 0.35)
  Top 0.254: v78.74,56.35 80.01,55.08 v105.41,55.08 | v46.99,123.66 46.99,119.85 33.02,119.85 22.86,130.01 22.86,137.63 12.7,147.79 8.89,147.79 J1.12
  Top 1.524: J1.12 J1.10 J1.8 J1.6 J1.4 J1.2
  Bottom 0.254: CPU0.12 v105.41,55.08 | v78.74,56.35 49.53,85.56 49.53,123.66 v46.99,123.66
N$5  (via drill 0.35)
  Top 0.254: v114.3,18.25 v80.01,52.54 | v45.72,122.39 31.75,122.39 24.13,130.01 24.13,137.63 12.7,149.06 7.62,149.06 6.35,147.79 J2.11
  Top 1.524: J2.11 J2.9 J2.7 J2.5 J2.3 J2.1
  Bottom 0.254: CPU0.16 v114.3,18.25 | v80.01,52.54 48.26,84.29 48.26,122.39 v45.72,122.39
N$6
  Top 0.381: U1.3 98.43,82.55
  Top 0.508: 98.43,82.55 98.38,82.6 R9.1
N$7  (via drill 0.35)
  Top 0.61: C20.+ 147.42,57.01 IC6.1 151.37,54.01 R13.1 153.48,54 v153.67,53.81 | D12.A 158.75,56.67 R14.2 157.48,54.76 v157.48,53.81
  Bottom 0.61: v157.48,53.81 v153.67,53.81
N$8
  Top 1.27: LED1.P$4
  Top 1.524: Q4.2 LED1.P$4
N$9
  Top 0.254: U3.3 161.58,100.12 R12.1
N$10
  Top 1.524: Q5.2 121.03,150.04 116.56,154.51 116.56,162 LED1.P$3
N$11
  Top 1.524: Q6.2 121.03,142.75 125.63,147.35 125.63,165.41 121.06,169.98 LED1.P$2
N$12
  Top 0.254: R15.1 34.71,18.96 U4.3
N$13
  Top 1.27: LED2.P$4
  Top 1.524: Q7.2 LED2.P$4
N$14
  Top 1.524: Q8.2 108.33,150.04 103.86,154.51 103.86,162 LED2.P$3
N$15
  Top 0.254: U2.3 163.03,22.69
  Top 0.61: 163.03,22.69 R18.1
N$16
  Top 1.27: LED2.P$2
  Top 1.524: LED2.P$2 108.33,169.95 112.93,165.36 112.93,147.28 108.33,142.68 Q9.2
N$17
  Top 0.254: CPU0.39 2.54,13.17 2.54,126.2 J3.2 5.08,126.2 12.7,126.2 J4.2
N$18
  Top 0.254: CPU0.40 1.27,11.9 1.27,130.01 6.35,130.01 | 6.35,130.01 J3.4 | J4.4 16.51,130.01 6.35,130.01
N$19  (via drill 0.35)
  Top 0.254: J3.6 12.25,127.47 13.46,128.69 14.47,128.69 15.29,127.87 15.29,126.97 16,126.25 17.02,126.25 18.23,127.47 J4.6 | CPU0.38 19.05,27.14 19.05,109.69 v22.86,113.5
  Bottom 0.254: v22.86,113.5 22.86,123.66 J4.6
PWM1_0
  Top 0.635: PWM0.PWM0 55.88,159.22 89.65,159.22 M0.P$3
PWM1_1
  Top 0.635: PWM0.PWM1 54.61,160.49 79.49,160.49 M1.P$3
PWM1_2
  Top 0.635: PWM0.PWM2 53.34,161.76 68.58,161.76 73.3,166.48 M2.P$3
PWM1_3
  Top 0.635: PWM0.PWM3 45.72,157.2 55,166.48 M3.P$3
PWM1_4
  Top 0.635: PWM0.PWM4 51.19,164.69 M4.P$3
PWM1_5
  Top 0.635: PWM0.PWM5 40.64,165.6 M5.P$3
PWM1_6
  Top 0.635: PWM0.PWM6 38.1,156.71 M6.P$3
PWM1_7
  Top 0.635: PWM0.PWM7 31.75,160.49 22.89,160.49 M7.P$3
PWM1_8
  Top 0.635: PWM0.PWM8 30.48,159.22 12.7,159.22 5.47,166.45 M8.P$3
PWM2_0
  Top 0.635: S0.P$3 175.26,164.82 PWM2.PWM0
PWM2_1
  Top 0.635: PWM2.PWM1 166.76,162.64 S1.P$3
PWM2_2
  Top 0.635: PWM2.PWM2 165.1,161.76 161.32,161.76 S2.P$3
PWM2_3
  Top 0.635: PWM2.PWM3 163.94,160.38 151.27,160.38 S3.P$3
R1
  Bottom 0.254: PWM1.PWM0 95.25,128.74 128.27,128.74 139.7,140.17 139.7,154.14 137.03,156.81 Q1.1
R2
  Bottom 0.254: PWM1.PWM3 99.06,132.55 121.92,132.55 128.27,138.9 128.27,154.14 125.6,156.81 Q4.1
R3
  Bottom 0.254: PWM1.PWM6 102.87,136.36 110.49,136.36 115.57,141.44 115.57,155.41 114.17,156.81 Q7.1
SS1  (via drill 0.35)
  Top 0.254: J3.3 12.7,118.58 v15.24,118.58 | v15.24,113.5 15.24,46.19 8.89,39.84 v8.89,38.57
  Bottom 0.254: v15.24,118.58 v15.24,113.5 | v8.89,38.57 8.89,30.95 6.35,28.41 CPU0.32
SS2  (via drill 0.35)
  Top 0.254: v17.78,113.5 17.78,43.65 CPU0.31
  Bottom 0.254: J4.3 16.51,114.77 v17.78,113.5

### Text on the board
tPlace: GND | SDA | SCL | 5v | MISO | SCLK | MISO | SCLK | MOSI | MOSI | PoolTable Backplane / Created by DART 2019 / Released under the GPLv3 | 5V | SS | GND | 5V | SS | GND
tNames: S4 | S3 | S2 | S1 | S0 | M8 | M7 | M6 | M5 | M4 | M3 | M2 | M1 | M0